# Altium schematic sheet Cartao_SD.SchDoc
size A4; SheetNumber: 7; SheetTotal: 7
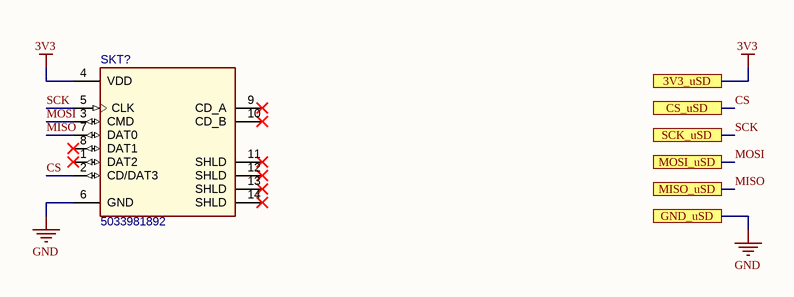
[diagram p0: Cartao_SD.SchDoc]

## Parts
SKT?  5033981892  [MOLX-5033981892_V]

## Ports
3V3_uSD, CS_uSD, GND_uSD, MISO_uSD, MOSI_uSD, SCK_uSD

## Nets
3V3: SKT?.4(VDD) ; port 3V3_uSD
GND: SKT?.6(GND) ; port GND_uSD
CS: SKT?.2(CD/DAT3) ; port CS_uSD
MISO: SKT?.7(DAT0) ; port MISO_uSD
MOSI: SKT?.3(CMD) ; port MOSI_uSD
SCK: SKT?.5(CLK) ; port SCK_uSD

Not connected (* = marked no-connect by the designer): SKT? 1(DAT2)* 8(DAT1)* 9(CD_A)* 10(CD_B)* 11(SHLD)* 12(SHLD)* 13(SHLD)* 14(SHLD)*

## Library data of the parts
SKT? = CMP-002-00049-3: Micro SD Card Connector, Pitch 1.1 mm, 8 Position, Height 1.4 mm, -25 to 85 degC, RoHS, Tape and Reel; Pins: 14